# EAGLE design filterCard (EAGLE 8.0.1)
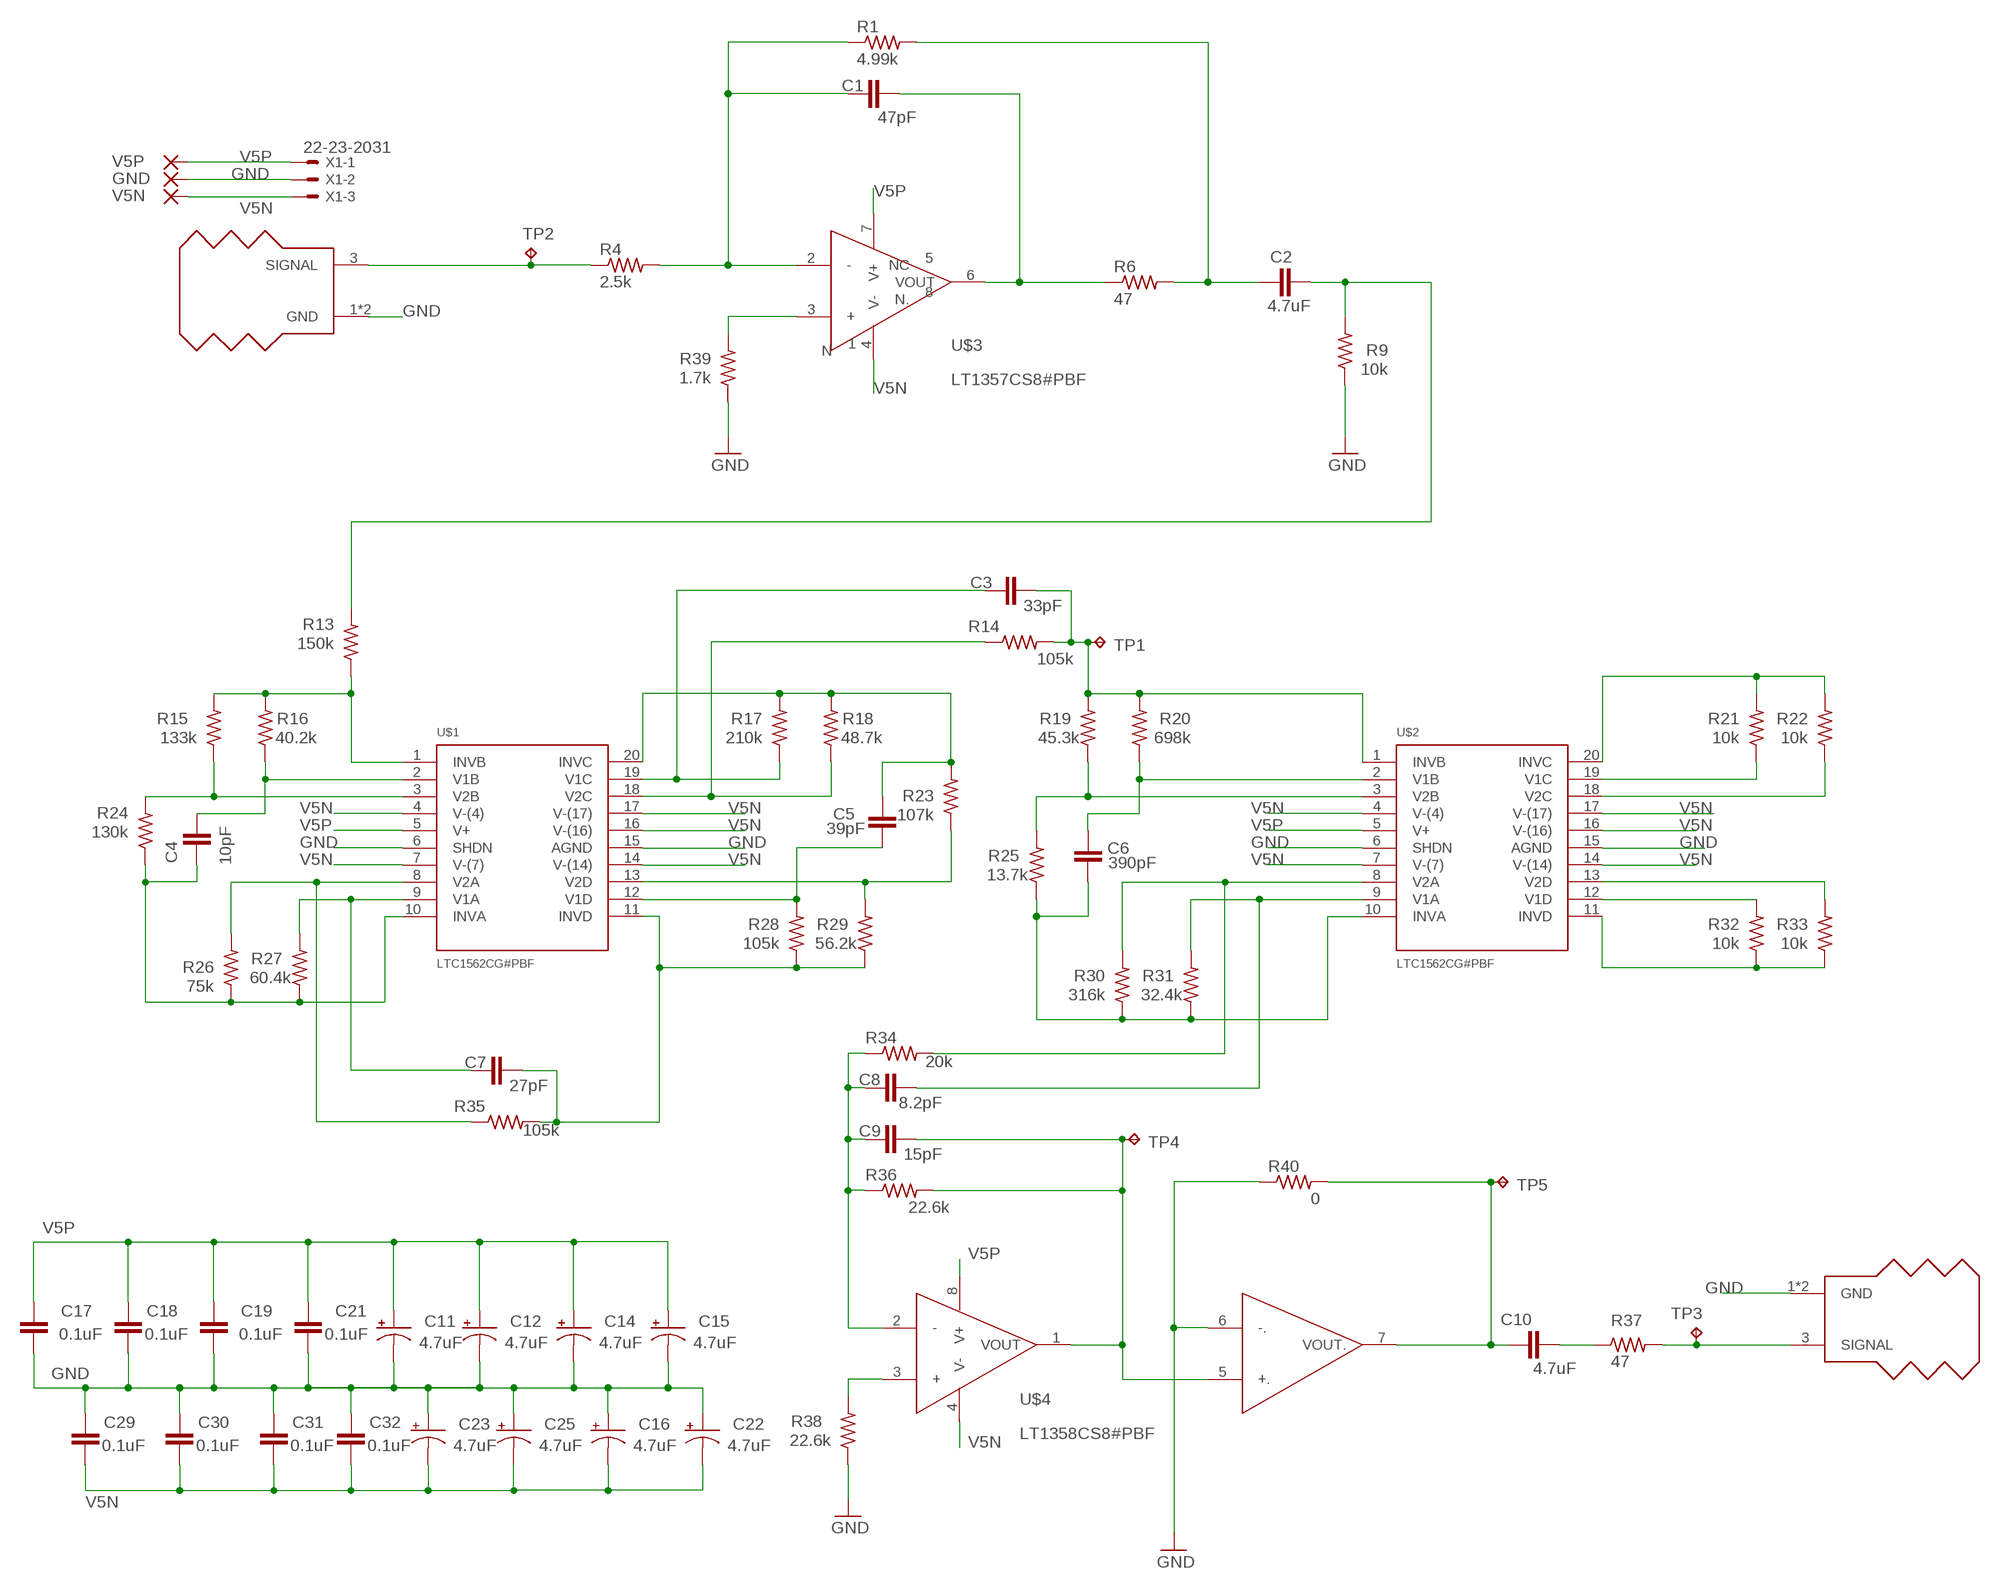
[diagram p0: schematic, sheet 1]

## Parts
C1  47pF  C0603  [0603]
C2  4.7uF  C1206  [1206]
C3  33pF  C1206  [1206]
C4  10pF  C1206  [1206]
C5  39pF  C1206  [1206]
C6  390pF  C1206  [1206]
C7  27pF  C1206  [1206]
C8  8.2pF  C1206  [1206]
C9  15pF  C1206  [1206]
C10  4.7uF  C1206  [1206]
C11  4.7uF  C1206-POLAR  [1206-POLAR]
C12  4.7uF  C1206-POLAR  [1206-POLAR]
C14  4.7uF  C1206-POLAR  [1206-POLAR]
C15  4.7uF  C1206-POLAR  [1206-POLAR]
C16  4.7uF  C1206-POLAR  [1206-POLAR]
C17  0.1uF  C0603  [0603]
C18  0.1uF  C0603  [0603]
C19  0.1uF  C0603  [0603]
C21  0.1uF  C0603  [0603]
C22  4.7uF  C1206-POLAR  [1206-POLAR]
C23  4.7uF  C1206-POLAR  [1206-POLAR]
C25  4.7uF  C1206-POLAR  [1206-POLAR]
C29  0.1uF  C0603  [0603]
C30  0.1uF  C0603  [0603]
C31  0.1uF  C0603  [0603]
C32  0.1uF  C0603  [0603]
GND  ground  2,54/0,8  [2,54/0,8]
R1  4.99k  R-US_R0603  [R0603]
R4  2.5k  R-US_R0603  [R0603]
R6  47  R-US_R1206  [R1206]
R9  10k  R-US_R1206  [R1206]
R13  150k  R-US_R1206  [R1206]
R14  105k  R-US_R1206  [R1206]
R15  133k  R-US_R1206  [R1206]
R16  40.2k  R-US_R1206  [R1206]
R17  210k  R-US_R1206  [R1206]
R18  48.7k  R-US_R1206  [R1206]
R19  45.3k  R-US_R1206  [R1206]
R20  698k  R-US_R1206  [R1206]
R21  10k  R-US_R1206  [R1206]
R22  10k  R-US_R1206  [R1206]
R23  107k  R-US_R1206  [R1206]
R24  130k  R-US_R1206  [R1206]
R25  13.7k  R-US_R1206  [R1206]
R26  75k  R-US_R1206  [R1206]
R27  60.4k  R-US_R1206  [R1206]
R28  105k  R-US_R1206  [R1206]
R29  56.2k  R-US_R1206  [R1206]
R30  316k  R-US_R1206  [R1206]
R31  32.4k  R-US_R1206  [R1206]
R32  10k  R-US_R1206  [R1206]
R33  10k  R-US_R1206  [R1206]
R34  20k  R-US_R1206  [R1206]
R35  105k  R-US_R1206  [R1206]
R36  22.6k  R-US_R1206  [R1206]
R37  47  R-US_R1206  [R1206]
R38  22.6k  R-US_R1206  [R1206]
R39  1.7k  R-US_R0603  [R0603]
R40  0  R-US_R0805  [R0805]
TP1  TPPAD1-17  [P1-17]
TP2  TPPAD1-13  [P1-13]
TP3  TPPAD1-13  [P1-13]
TP4  TPPAD1-17  [P1-17]
TP5  TPPAD1-17  [P1-17]
U$1  LTC1562CG#PBF  [TSSOP20]
U$2  LTC1562CG#PBF  [TSSOP20]
U$3  LT1357CS8#PBF  [8-SOIC]
U$4  LT1358CS8#PBF  [8-SOIC]
U$5  MY_SMASMD  [MY_SMA]
U$6  MY_SMASMD  [MY_SMA]
V5N  -5  2,54/0,8  [2,54/0,8]
V5P  5  2,54/0,8  [2,54/0,8]
X1  22-23-2031  [22-23-2031]

## Nets
GND: C11.- C12.- C14.- C15.- C16.+ C17.2 C18.2 C19.2 C21.2 C22.+ C23.+ C25.+ C29.1 C30.1 C31.1 C32.1 GND.1(P) R9.1 R38.1 R39.1 R40.1 U$1.6(SHDN) U$1.15(AGND) U$2.6(SHDN) U$2.15(AGND) U$4.6(-.) U$5.1(GND) U$5.2(GND) U$6.1(GND) U$6.2(GND) X1.2
N$1: C7.1 R27.2 U$1.9(V1A)
N$2: R26.2 R35.1 U$1.8(V2A)
N$3: C4.2 R24.1 R26.1 R27.1 U$1.10(INVA)
N$4: R15.1 R24.2 U$1.3(V2B)
N$5: C7.2 R28.1 R29.1 R35.2 U$1.11(INVD)
N$6: C4.1 R16.1 U$1.2(V1B)
N$7: R39.2 U$3.3(+)
N$8: C5.2 R28.2 U$1.12(V1D)
N$9: R13.1 R15.2 R16.2 U$1.1(INVB)
N$10: R23.1 R29.2 U$1.13(V2D)
N$11: C1.1 R1.1 R4.2 U$3.2(-)
N$12: C3.2 R14.2 R19.2 R20.2 TP1.TP U$2.1(INVB)
N$13: C3.1 R17.1 U$1.19(V1C)
N$14: R14.1 R18.1 U$1.18(V2C)
N$15: C5.1 R17.2 R18.2 R23.2 U$1.20(INVC)
N$16: C10.1 R40.2 TP5.TP U$4.7(VOUT.)
N$17: R19.1 R25.2 U$2.3(V2B)
N$18: C6.1 R20.1 U$2.2(V1B)
N$19: C1.2 R6.1 U$3.6(VOUT)
N$20: C6.2 R25.1 R30.1 R31.1 U$2.10(INVA)
N$21: C8.2 R31.2 U$2.9(V1A)
N$22: R30.2 R34.2 U$2.8(V2A)
N$23: C10.2 R37.1
N$24: R21.1 U$2.19(V1C)
N$25: R22.1 U$2.18(V2C)
N$26: R21.2 R22.2 U$2.20(INVC)
N$27: R32.2 U$2.12(V1D)
N$28: R33.2 U$2.13(V2D)
N$29: R32.1 R33.1 U$2.11(INVD)
N$30: C2.1 R1.2 R6.2
N$31: R4.1 TP2.TP U$5.3(SIGNAL)
N$32: C2.2 R9.2 R13.2
N$33: R37.2 TP3.TP U$6.3(SIGNAL)
N$35: C8.1 C9.1 R34.1 R36.1 U$4.2(-)
N$37: R38.2 U$4.3(+)
N$38: C9.2 R36.2 TP4.TP U$4.1(VOUT) U$4.5(+.)
V5N: C16.- C22.- C23.- C25.- C29.2 C30.2 C31.2 C32.2 U$1.4(V-(4)) U$1.7(V-(7)) U$1.14(V-(14)) U$1.16(V-(16)) U$1.17(V-(17)) U$2.4(V-(4)) U$2.7(V-(7)) U$2.14(V-(14)) U$2.16(V-(16)) U$2.17(V-(17)) U$3.4(V-) U$4.4(V-) V5N.1(P) X1.3
V5P: C11.+ C12.+ C14.+ C15.+ C17.1 C18.1 C19.1 C21.1 U$1.5(V+) U$2.5(V+) U$3.7(V+) U$4.8(V+) V5P.1(P) X1.1
Unconnected: U$3.1(N) U$3.5(NC) U$3.8(N.)

## Library data of the parts
C1 C17-C19 C21 C29-C32 = filtercard_parts:C0603
C2-C10 = filtercard_parts:C1206
C11 C12 C14-C16 C22 C23 C25 = filtercard_parts:C1206-POLAR
GND V5N V5P = wirepad:2,54/0,8: THROUGH-HOLE PAD
R1 R4 R6 R9 R13-R22 R28 R32 R33 R35 R37-R40 = resistor:R-US_: RESISTOR, American symbol
R23-R27 R29-R31 R34 R36 = rcl:R-US_: RESISTOR, American symbol
TP1-TP5 = testpad:TP: Test pad
U$1 U$2 = filtercard_parts:LTC1562CG#PBF
U$3 = filtercard_parts:LT1357CS8#PBF
U$4 = filtercard_parts:LT1358CS8#PBF
U$5 U$6 = MY_SMA:MY_SMA
X1 = con-molex:22-23-2031: .100" (2.54mm) Center Header - 3 Pin; MF: MOLEX; MPN: 22-23-2031; OC_FARNELL: 1462950; OC_NEWARK: 30C0862

## Board
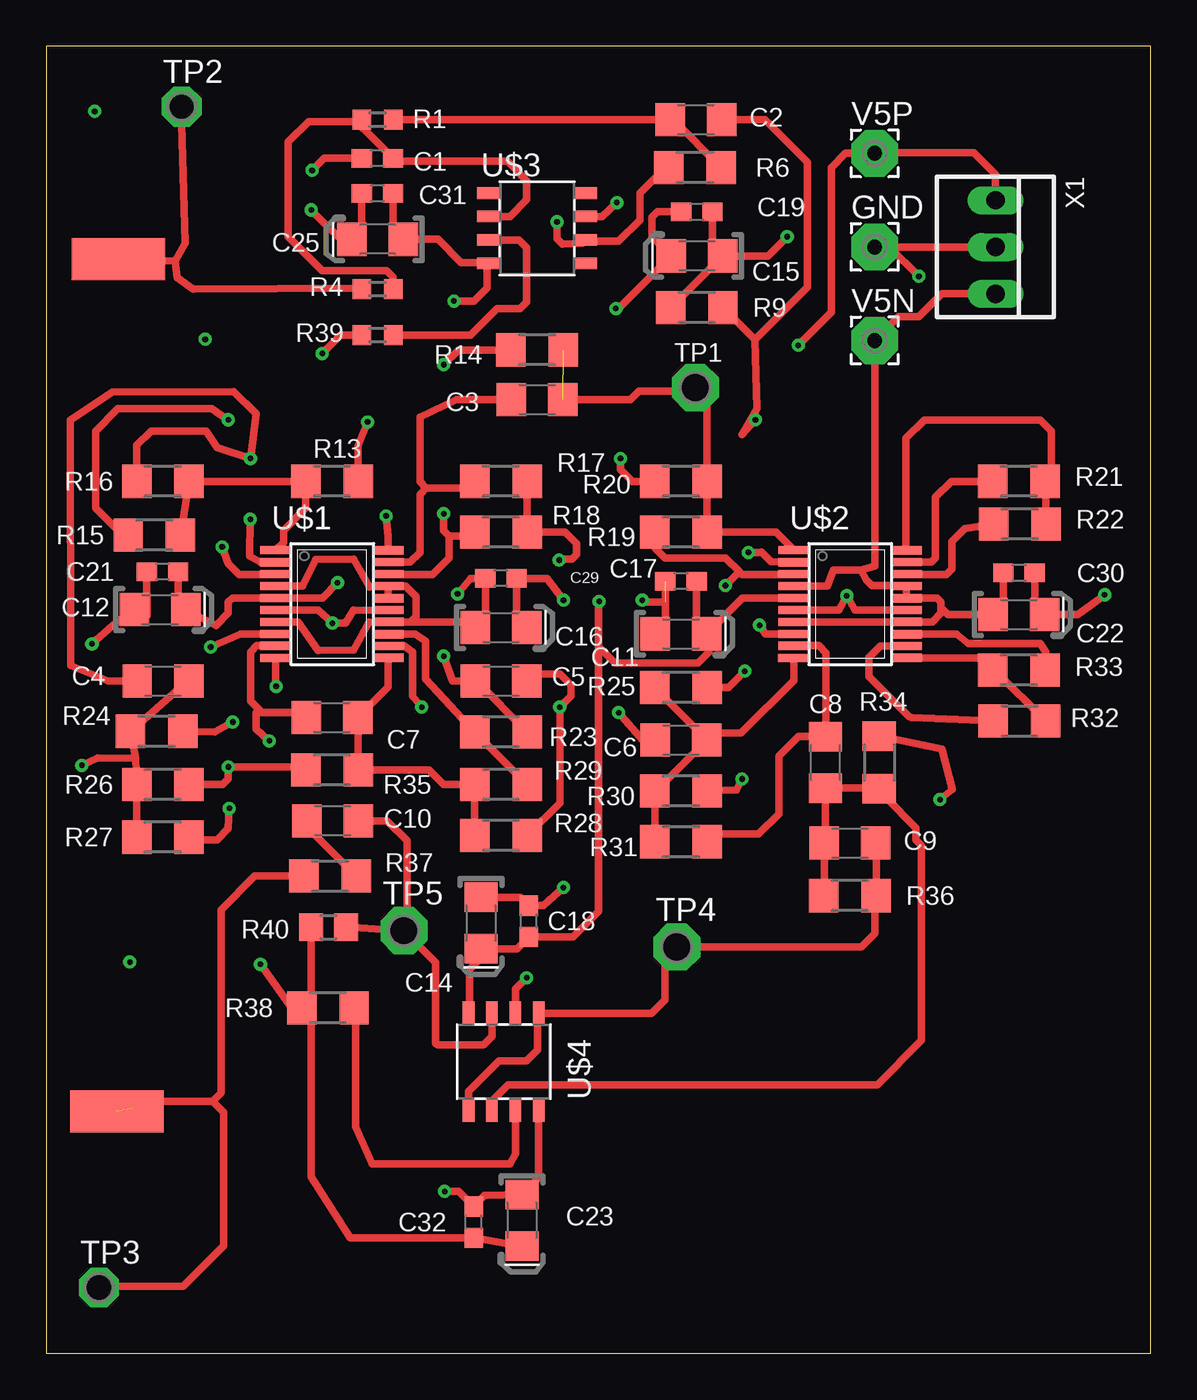
[diagram p1: board, top side]
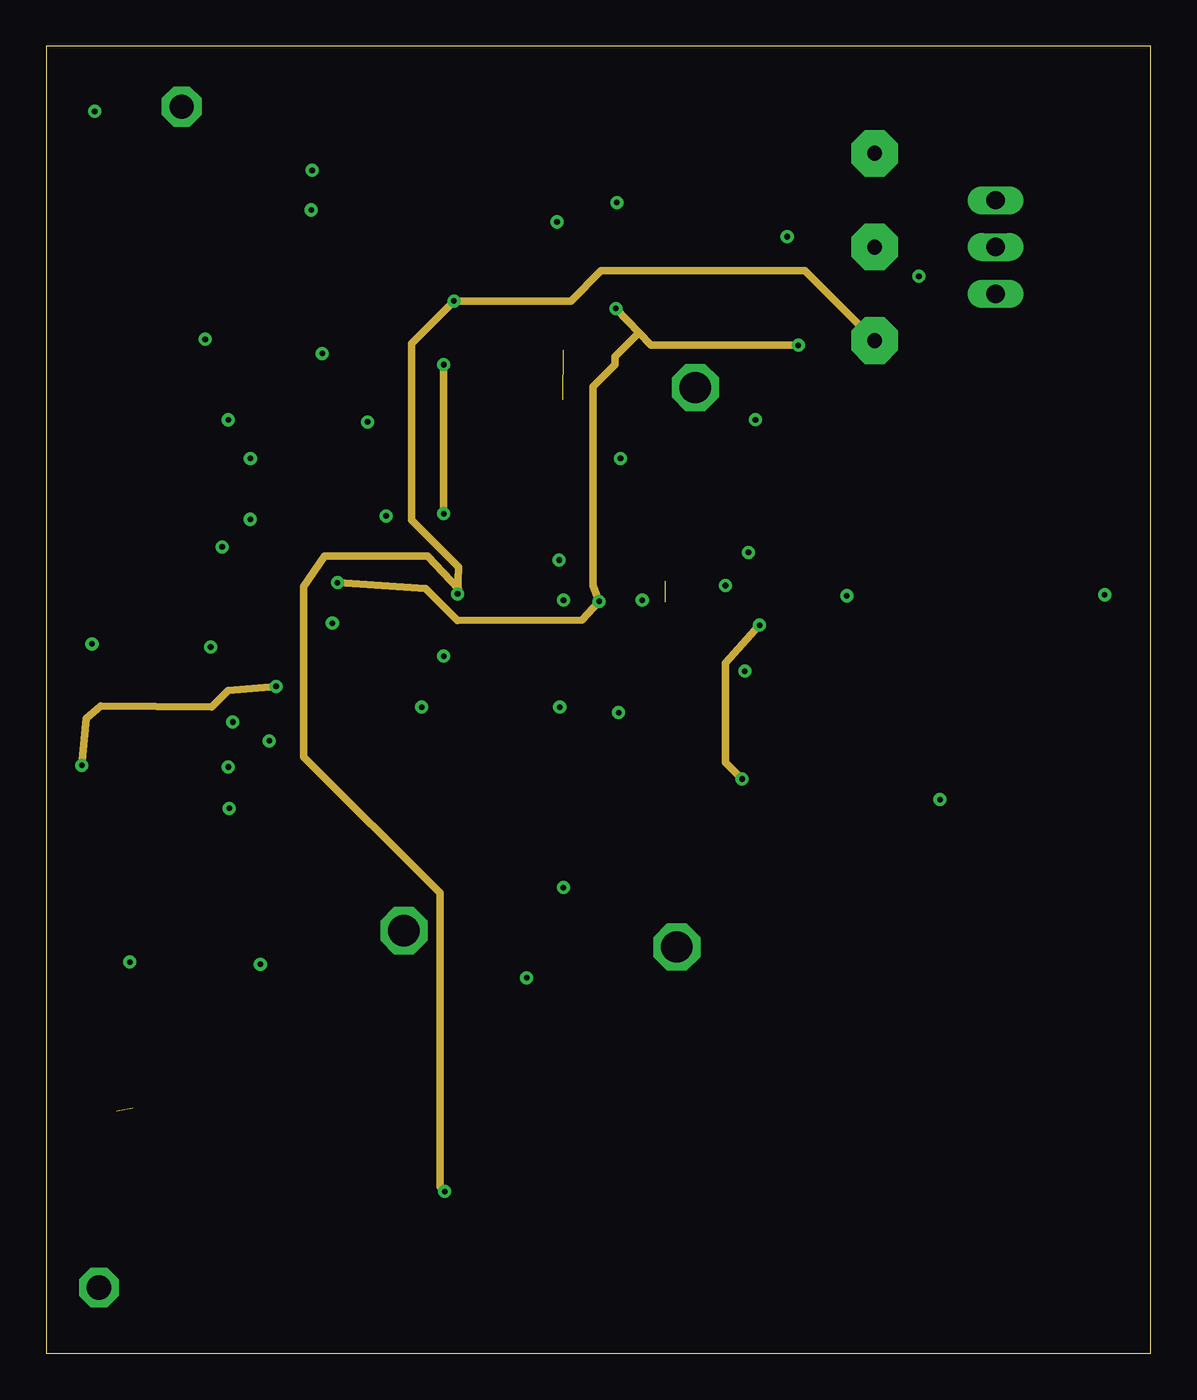
[diagram p2: board, inner layer Route2]
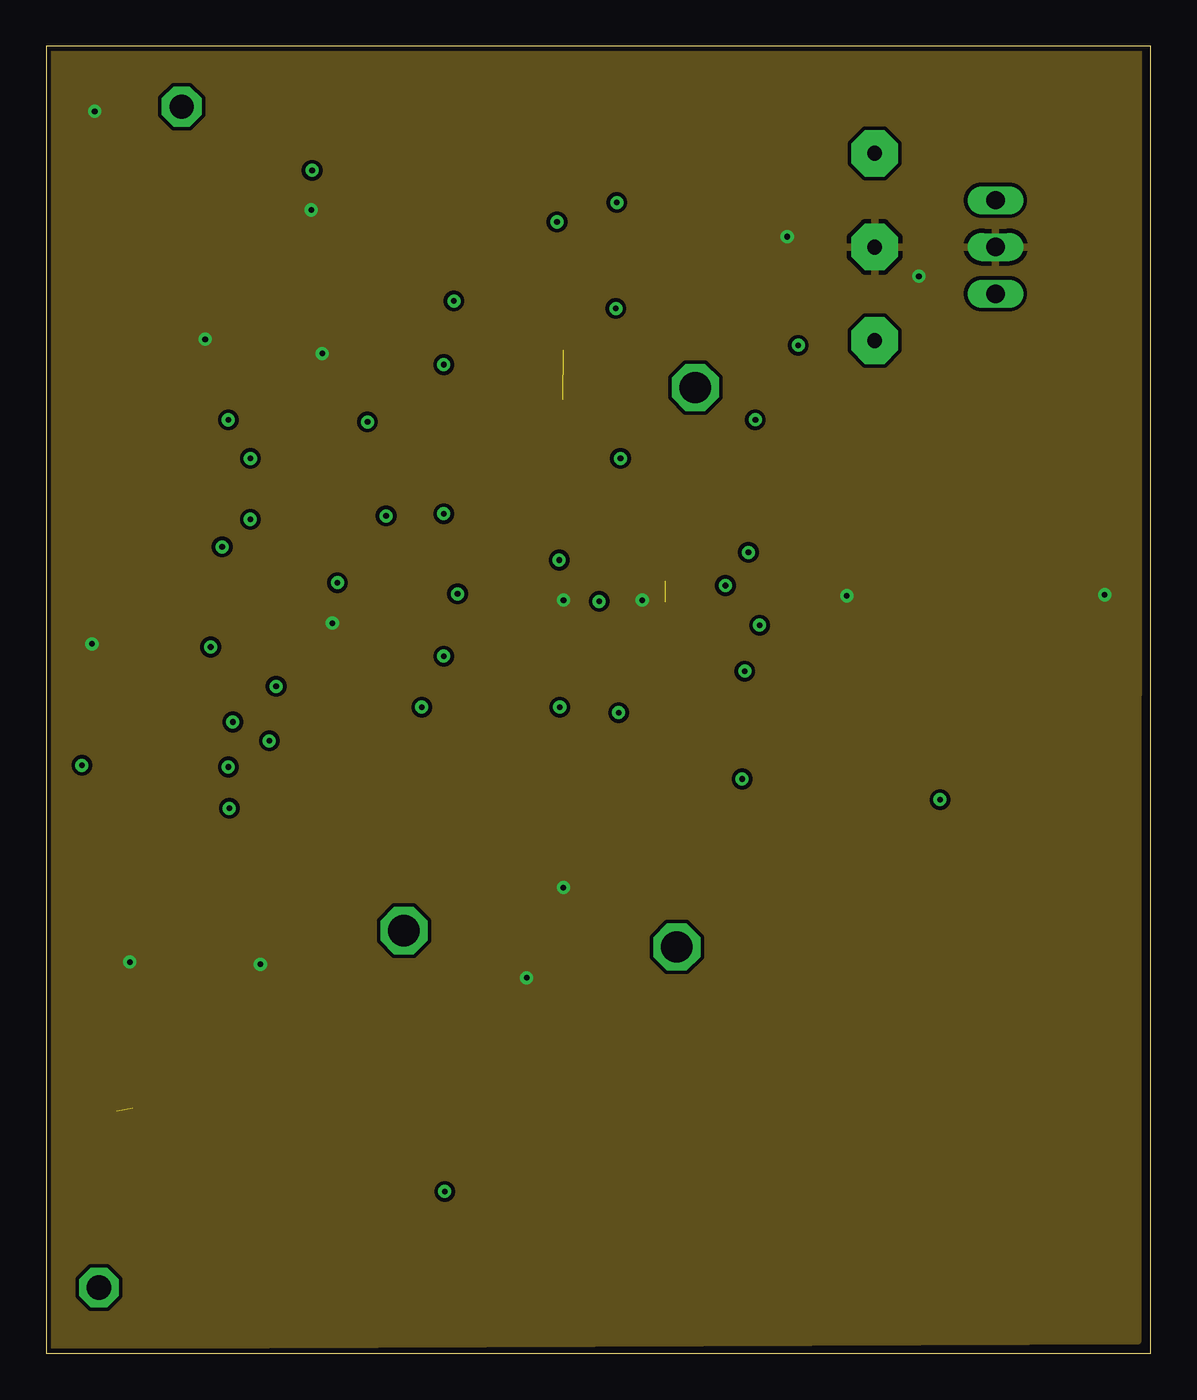
[diagram p3: board, inner layer Route3]
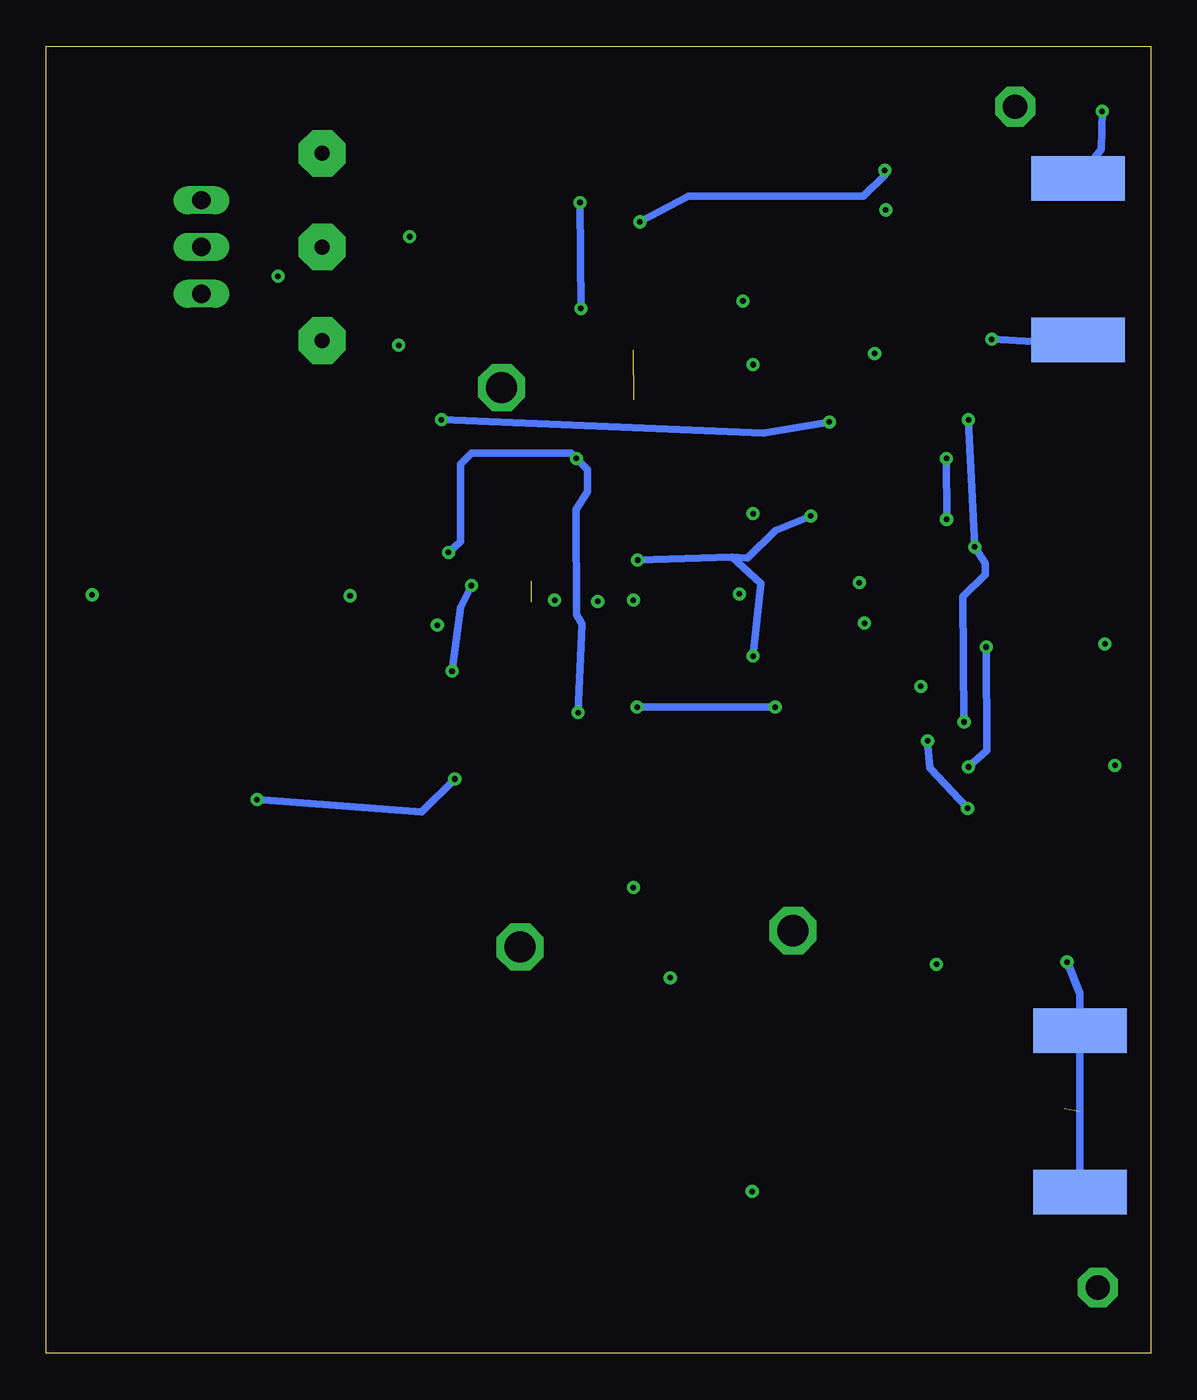
[diagram p4: board, bottom side, seen from below]

Size 60 x 71 mm. Coordinates in mm from the lower left corner, seen from the top.
Outline: 0,0 60,0 60,71 0,71 0,0
Copper layers (1*2*3*16): Top 0.035mm / dielectric 1.5mm / Route2 0.035mm / dielectric 0.15mm / Route3 0.035mm / dielectric 0.2mm / Bottom 0.035mm
Design rules "4pcb *": minimum track width 8mil, minimum drill 10mil, track to track 8mil, track to pad 6mil, pad to pad 6mil, via to via 8mil, smd to smd 8mil, copper to edge 10mil, drill to drill 8mil, minimum pad ring 10mil, minimum via ring 8mil, stop-mask expansion 4mil, vias tented up to drill 0mil, thermal gap 10mil

### Footprints (pad centres in the part's own frame; a part is rotated, then mirrored left to right if it is on the bottom)
0603 = smd 1.1 x 1: 1 -0.85,0; 2 0.85,0
1206 = smd 1.6 x 1.8: 1 -1.4,0; 2 1.4,0
1206-POLAR = smd 1.6 x 1.8: + 1.4,0; - -1.4,0
2,54/0,8 = drill 0.813 pad 2.54 octagon: 1 0,0
R0603 = smd 1 x 1.1: 1 -0.85,0; 2 0.85,0
R1206 = smd 1.6 x 1.803: 1 -1.422,0; 2 1.422,0
R0805 = smd 1.3 x 1.5: 1 -0.95,0; 2 0.95,0
P1-17 = drill 1.702 pad 2.54 octagon: TP 0,0
P1-13 = drill 1.321 pad 2.159 octagon: TP 0,0
TSSOP20 = smd 0.45 x 1.7: 1 -2.927,-3.047; 2 -2.272,-3.042; 3 -1.627,-3.052; 4 -0.972,-3.042; 5 -0.322,-3.042; 6 0.328,-3.047; 7 0.978,-3.047; 8 1.628,-3.047; 9 2.263,-3.047; 10 2.928,-3.052; 11 2.923,3.052; 12 2.278,3.057; 13 1.638,3.047; 14 0.973,3.052; 15 0.328,3.052; 16 -0.312,3.052; 17 -0.972,3.052; 18 -1.622,3.052; 19 -2.277,3.052; 20 -2.917,3.047
8-SOIC = smd 1.27 x 0.635: 1 -2.629,1.905; 2 -2.629,0.635; 3 -2.629,-0.635; 4 -2.629,-1.905; 5 2.629,-1.905; 6 2.629,-0.635; 7 2.629,0.635; 8 2.629,1.905
MY_SMA = smd 5.08 x 2.413 bottom: 1 2.54,4.381; 2 2.54,-4.381 | smd 5.08 x 2.286: 3 2.54,0
22-23-2031 = drill 1 long: 1 -2.54,0; 2 0,0; 3 2.54,0

### Placement (x,y rotation side)
C1  18,64.9 180 top
C2  35.29,67 0 top
C3  26.67,51.8 0 top
C4  6.35,36.51 0 top
C5  24.71,36.51 0 top
C6  34.48,33.31 0 top
C7  15.53,34.54 0 top
C8  42.33,32.1 90 top
C9  43.66,27.72 0 top
C10  15.57,28.92 180 top
C11  34.48,39.08 0 top
C12  6.19,40.4 0 top
C14  23.62,23.38 270 top
C15  35.34,59.6 180 top
C16  24.71,39.43 0 top
C17  34.48,41.94 180 top
C18  26.22,23.47 90 top
C19  35.34,62 0 top
C21  6.33,42.46 180 top
C22  52.84,40.13 0 top
C23  25.85,7.23 270 top
C25  18,60.5 180 top
C29  24.71,42.09 180 top
C30  52.84,42.39 180 top
C31  18,63 0 top
C32  23.23,7.13 90 top
GND  45,60.09 0 top
R1  18,67 0 top
R4  18,57.8 0 top
R6  35.24,64.4 0 top
R9  35.34,56.8 0 top
R13  15.53,47.36 0 top
R14  26.67,54.5 0 top
R15  5.88,44.44 0 top
R16  6.35,47.36 0 top
R17  24.71,47.36 0 top
R18  24.71,44.6 0 top
R19  34.48,44.6 0 top
R20  34.48,47.36 0 top
R21  52.84,47.36 0 top
R22  52.89,45.04 0 top
R23  24.71,33.75 0 top
R24  6.01,33.79 0 top
R25  34.48,36.16 0 top
R26  6.35,30.9 0 top
R27  6.35,28.04 0 top
R28  24.71,28.14 0 top
R29  24.71,30.9 0 top
R30  34.48,30.55 0 top
R31  34.48,27.79 0 top
R32  52.86,34.34 180 top
R33  52.84,37.12 0 top
R34  45.25,32.1 90 top
R35  15.53,31.69 0 top
R36  43.66,24.86 0 top
R37  15.42,25.93 180 top
R38  15.31,18.77 0 top
R39  18,55.3 0 top
R40  15.34,23.15 0 top
TP1  35.26,52.45 0 top
TP2  7.37,67.71 0 top
TP3  2.88,3.58 0 top
TP4  34.26,22.07 0 top
TP5  19.43,22.96 0 top
U$1  15.53,40.7 270 top
U$2  43.66,40.7 270 top
U$3  26.67,61.1 0 top
U$4  24.85,15.85 90 top
U$5  1.4,59.43 0 top
U$6  1.31,13.14 0 top
V5N  45,55.01 0 top
V5P  45,65.17 0 top
X1  51.56,60.09 270 top

### Tracks (layer width: path | path; a pad name or v marks a point on that pad's centre or on a via)
GND  (via drill 0.3 pad 0.51)  (1 unrouted)
  Top 0.406: C31.1 17.15,61.05 C25.+ 16,60.5 v14.4,62.1 | R9.1 33.94,56.8 C15.- | R39.1 16,55.3 v15,54.3 | C15.- 39.2,59.6 v40.25,60.65 | X1.2 GND.1 45.81,60.09 v47.4,58.5 | C19.2 36.19,60.15 C15.- | R40.1 14.39,19.27 R38.1 | R38.1 13.33,18.77 v11.64,21.14 | C14.- 25.77,24.78 C18.2 27.02,24.32 v28.1,25.3 | C23.+ 23.25,6.28 C32.1 16.52,6.28 14.4,9.6 14.4,18.25 R38.1 | C16.+ 25.56,39.98 C29.1 27.21,42.09 v28.1,40.91 | C17.2 33.63,39.63 C11.- | 33.63,40.8 32.7,40.8 v32.38,40.91 | C30.1 53.69,40.68 C22.+ 56.03,40.13 v57.5,41.2 | C21.2 5.5,40.08 C12.- 3.63,39.53 v2.49,38.53 | U$2.6 43.07,40.37 v43.48,41.15 43.93,40.37 U$2.15 | U$4.6 25.48,19.79 v26.1,20.4 | U$1.6 14.79,40.36 v15.55,39.66 16.28,39.66 16.69,40.38 18.56,40.35 U$1.15
  Bottom 0.406: U$5.1 2.7,65.4 v2.65,67.46 | U$5.2 6.34,54.94 v8.64,55.08 | U$6.2 U$6.1 3.85,19.55 v4.55,21.26
  pour Route3: 0.3,70.79 0.35,0.43 59.29,0.7 59.32,70.75
N$1  (via drill 0.3 pad 0.51)
  Top 0.406: U$1.9 11.44,38.44 11.1,38.1 11.1,35.44 11.73,34.8 | 11.73,34.8 11.4,34.8 11.4,33.9 v12.12,33.26 | 11.73,34.8 13.87,34.8 C7.1 | v9.95,29.6 9.9,28.5 9.3,27.9 7.91,27.9 R27.2
  Bottom 0.406: v12.12,33.26 12,31.8 v9.95,29.6
N$2  (via drill 0.3 pad 0.51)
  Top 0.406: U$1.8 10.57,39.07 v8.94,38.36 | R26.2 9.6,30.9 9.9,31.2 v9.9,31.85 13.69,31.85 R35.1
  Bottom 0.406: v8.94,38.36 8.91,32.75 v9.9,31.85
N$3  (via drill 0.3 pad 0.51)
  Top 0.406: C4.2 7.69,36.51 R24.1 | U$1.10 12.48,36.18 v12.49,36.23 | 4.48,33.3 R24.1 | R24.1 4.88,32.3 | 4.88,32.3 R26.1 R27.1 | 4.88,32.3 2.8,32.34 v1.95,31.94
  Route2 0.406: v12.49,36.23 9.9,36 9,35.1 2.98,35.17 2.18,34.48 v1.95,31.94
N$4  (via drill 0.3 pad 0.51)
  Top 0.406: R15.1 4.16,44.44 2.7,45.9 2.7,50.1 3.9,51.3 9,51.3 v9.9,50.7 | v9.56,43.8 9.9,42.9 10.5,42.3 12.45,42.3 U$1.3 | R24.2 9.15,33.75 v10.14,34.29
  Bottom 0.406: v9.9,50.7 v9.56,43.8 9,42.9 9,42.3 10.2,41.1 v10.14,34.29
N$5
  Top 0.406: U$1.11 18.58,36.19 C7.2 16.95,34.52 R35.2 20.81,31.69 21.6,30.9 R29.1 R28.1
N$6  (via drill 0.3 pad 0.51)
  Top 0.406: R16.1 4.93,49.33 5.7,50.1 8.7,50.1 9.3,49.2 v11.1,48.6 11.4,51.04 10.2,52.24 3.6,52.2 1.32,50.69 1.35,37.35 3.39,36.51 C4.1 | v11.09,45.3 11.05,43.3 11.63,42.97 U$1.2
  Bottom 0.406: v11.1,48.6 v11.09,45.3
N$7
  Top 0.406: R39.2 23.05,55.3 24.5,56.75 25.75,56.75 26.1,57.1 26.1,60.05 25.7,60.45 24.06,60.45 U$3.3
N$8  (via drill 0.3 pad 0.51)
  Top 0.406: U$1.12 19.48,38.42 19.91,38.1 19.91,35.7 v20.4,35.1 | C5.2 26.49,36.9 27.9,36.9 28.5,36.3 28.5,35.7 v27.9,35.1 27.9,29.91 R28.2
  Bottom 0.406: v20.4,35.1 v27.9,35.1
N$9
  Top 0.406: U$1.1 12.9,44.05 12.9,44.7 14.11,45.91 R13.1 R16.2 R15.2
N$10
  Top 0.406: U$1.13 20.04,39.06 20.61,38.7 20.61,36.64 R23.1 R29.2
N$11
  Top 0.406: R1.1 17.15,66.6 17.38,66.38 | 17.38,66.38 C1.1 19,64.75 25.05,64.75 26.1,63.7 26.1,62.65 25.19,61.74 U$3.2 | R4.2 18.85,58.45 18.5,58.8 15,58.8 13.15,60.65 13.15,65.8 14.25,66.9 16.85,66.9 17.38,66.38
N$12  (1 unrouted)
  Top 0.406: C3.2 31.75,51.8 32.2,52.25 35.06,52.25 TP1.TP 35.9,51.81 R20.2 R19.2 39.64,44.6 U$2.1
N$13
  Top 0.406: C3.1 22.3,51.8 20.3,50.85 20.3,47.35 20.65,47 | R17.1 22.92,47 20.65,47 | U$1.19 19.78,42.98 20.3,43.5 20.3,46.65 20.65,47
N$14  (via drill 0.3 pad 0.51)
  Top 0.406: R14.1 22.4,54.5 v21.6,53.7 | v21.6,45.6 21.6,44.7 21.9,44.4 | 21.9,44.4 23.08,44.4 R18.1 | 21.9,44.4 21.9,43.2 21,42.3 18.6,42.3 U$1.18
  Route2 0.406: v21.6,53.7 v21.6,45.6
N$15  (via drill 0.3 pad 0.51)
  Top 0.406: R17.2 R18.2 | U$1.20 18.57,44.38 v18.47,45.48 | 26.33,44.4 R18.2 | 26.23,44.7 R18.2 | v21.6,37.87 22.09,36.51 C5.1 23.37,36.51 R23.2 | R18.2 28.18,44.6 28.81,43.97 28.81,43.38 28.57,43.14 27.92,43.14 v27.87,43.09
  Bottom 0.406: v18.47,45.48 20.4,44.7 21.9,43.2 22.75,43.26 | 22.75,43.26 v27.87,43.09 | v21.6,37.87 21.16,41.82 22.75,43.26
N$16
  Top 0.406: TP5.TP R40.2 | C10.1 18.53,28.92 19.6,27.85 19.6,23.13 TP5.TP | U$4.7 24.21,17.21 23.75,16.75 21.25,16.75 21.15,16.85 21.15,21.24 TP5.TP
N$17  (via drill 0.3 pad 0.51)
  Top 0.406: R19.1 33.06,43.74 33.6,43.2 36.9,43.2 37.65,42.45 | 37.65,42.45 37.8,42.3 40.58,42.3 U$2.3 | R25.2 37.06,36.16 v37.95,37.05 | v36.9,41.7 37.65,42.45
  Bottom 0.406: v37.95,37.05 37.5,40.5 v36.9,41.7
N$18  (via drill 0.3 pad 0.51)
  Top 0.406: R20.1 31.84,47.36 31.2,48 v31.2,48.6 | 38.7,43.5 v38.15,43.5 38.84,43.52 39.37,43 U$2.2 | C6.1 32.39,33.31 v31.1,34.8
  Bottom 0.406: v38.15,43.5 37.5,44.1 37.5,48.3 36.9,48.9 31.5,48.9 v31.2,48.6 30.6,48 30.6,46.8 31.23,45.83 31.2,40.13 30.9,39.6 v31.1,34.8
N$19  (via drill 0.3 pad 0.51)
  Top 0.406: R6.1 33.65,64.4 32.25,63 32.25,61.55 31.1,60.4 29.37,60.4 U$3.6 29.13,60.3 28.05,60.25 27.75,60.55 v27.75,61.45 | C1.2 15.1,64.9 v14.45,64.25
  Bottom 0.406: v14.45,64.25 14.45,64 15.6,62.85 25.1,62.85 v27.75,61.45
N$20
  Top 0.406: R25.1 33.06,36.13 C6.2 | R31.1 R30.1 33.12,30.55 C6.2 | U$2.10 40.61,36.56 37.75,33.7 36.28,33.7 C6.2
N$21
  Top 0.406: R31.2 36.32,28.2 38.7,28.2 39.8,29.3 39.8,32.45 40.85,33.5 C8.2 42.35,33.52 42.35,38.05 41.96,38.44 U$2.9
N$22  (via drill 0.3 pad 0.51)
  Top 0.406: v37.8,31.2 37.5,30.6 R30.2 | U$2.8 39.08,39.07 v38.75,39.55 | R34.2 47.73,33.01 48.65,32.83 49.21,30.64 v48.55,30.08
  Route2 0.406: v38.75,39.55 36.9,37.5 36.9,32.1 v37.8,31.2
  Bottom 0.406: v48.55,30.08 39.6,29.4 v37.8,31.2
N$23
  Top 0.406: C10.2 14.17,28.6 R37.1
N$24
  Top 0.406: R21.1 49.16,47.36 48.3,46.5 48.3,43.2 48.08,42.98 U$2.19
N$25
  Top 0.406: R22.1 49.89,44.79 49.2,44.1 49.2,42.6 48.9,42.3 46.73,42.3 U$2.18
N$26
  Top 0.406: R22.2 R21.2 54.6,47.7 54.6,50.1 54,50.7 47.7,50.7 46.71,49.71 U$2.20
N$27
  Top 0.406: U$2.12 45.32,38.42 44.7,37.8 44.7,36.75 46.85,34.6 47,34.54 R32.2
N$28
  Top 0.406: U$2.13 49.44,39.06 50.1,38.55 54,38.55 54.3,38.1 54.3,37.16 R33.2 54,37.38
N$29
  Top 0.406: R32.1 51.51,37.12 R33.1 50.76,37.78 U$2.11
N$30
  Top 0.406: R6.2 34.06,67 C2.1 R1.2
N$31
  Top 0.406: U$5.3 7.03,59.33 | 7.03,59.33 7.55,60.3 7.35,67.69 TP2.TP | 7.03,59.33 7.13,58.42 8,57.8 17.1,57.85 R4.1
N$32  (via drill 0.3 pad 0.51)
  Top 0.406: R9.2 36.76,56.79 38.5,55.05 | 38.5,55.05 38.62,51.3 37.8,49.89 v38.52,50.7 | 17.15,47.56 R13.2 16.95,49.31 v17.46,50.59 | C2.2 39.05,67 41.35,64.7 41.35,57.9 38.5,55.05
  Bottom 0.406: v38.52,50.7 21.05,49.98 v17.46,50.59
N$33  (1 unrouted)
  Top 0.406: R37.2 11.33,25.93 9.5,24.1 9.5,14.15 9.05,13.7 | 9.05,13.7 5.1,13.7 4.7,13.3 | 9.05,13.7 9.65,13.1 9.65,5.85 7.45,3.65 2.95,3.65 TP3.TP
N$35
  Top 0.406: U$4.2 24.21,13.71 25.1,14.6 45.15,14.6 47.55,17 47.55,27.6 47.25,27.9 47.25,28.55 45.6,30.2 45.6,30.32 R34.1 45.22,30.7 C8.1 42.33,27.79 C9.1 42.26,24.88 | 42.26,24.88 R36.1 42.26,24.88
N$37
  Top 0.406: U$4.3 25.48,10.84 25.2,10.3 17.7,10.3 16.8,12.3 16.8,18.7 R38.2
N$38
  Top 0.406: C9.2 45.08,27.7 R36.2 45,24.78 45,22.8 44.27,22.07 TP4.TP 33.6,21.42 33.6,19.2 32.88,18.48 U$4.5 26.7,18.42 26.7,16.5 26.1,15.9 24.6,15.9 22.95,14.25 U$4.1
V5N  (via drill 0.3 pad 0.51)
  Top 0.406: U$1.17 U$1.16 | 19.8,39.73 U$1.14 18.55,39.7 17.53,39.72 16.7,38.19 14.77,38.17 13.68,39.72 U$1.7 | 19.8,39.73 23.01,39.73 C16.- 23.86,39.98 C29.2 23.04,42.09 v22.35,41.25 | U$1.17 19.53,41.67 20.1,41.1 20.1,40.03 19.8,39.73 | C30.2 51.99,40.68 C22.- 48.97,40.13 48.6,40.5 | U$2.7 U$2.14 48.13,39.73 48.6,40.2 48.6,40.5 | 48.6,40.5 48.6,40.8 48.39,41.01 U$2.16 U$2.17 46.68,41.7 44.85,41.7 44.55,42 44.25,42.53 | U$2.4 42.42,41.67 42.75,42.53 44.25,42.53 | U$1.4 13.92,41.67 14.65,43.12 16.71,43.15 17.58,41.63 18.55,41.7 U$1.17 | C31.2 18.85,61.05 C25.- 21.3,60.5 22.55,59.25 23.99,59.25 U$3.4 23.95,59.11 23.95,57.85 23.25,57.15 v22.15,57.15 | v21.65,8.8 22.41,8.8 C32.2 23.83,8.58 23.93,8.58 C23.- 26.75,9.54 U$4.4 | X1.3 48.65,57.55 47.4,56.3 46.29,56.3 V5N.1 45,42.75 44.25,42.53
  Route2 0.406: v21.65,8.8 21.4,9.05 21.4,25 14,32.4 14,41.65 15.13,43.29 20.72,43.31 22.4,41.5 v22.35,41.25 22.4,42.7 19.85,45.25 19.85,54.85 v22.15,57.15 28.5,57.15 30.15,58.8 41.21,58.8 V5N.1
V5P  (via drill 0.3 pad 0.51)
  Top 0.406: C19.1 33.2,62 32.9,61.7 32.9,60.64 C15.+ 31.09,56.75 v30.95,56.75 | X1.1 51.56,64.04 50.4,65.2 45.03,65.2 V5P.1 43.42,65.17 42.65,64.4 42.65,56.55 v40.85,54.75 | C17.1 35.33,39.63 C11.+ | 30,38.4 30,24 28.62,22.62 C18.1 25.58,21.98 C14.+ 23.62,21.47 23,20.85 23,18.53 U$4.8 | 30,38.4 30,40.2 v30.04,40.84 | 30,38.4 30.9,37.5 35.4,37.5 36,38.1 36,38.96 C11.+ | U$2.5 37.82,41.02 C11.+ | C21.1 7.2,40.08 C12.+ 9.23,39.53 9.9,40.2 9.9,40.8 10.12,41.02 U$1.5 15.02,41.02 v15.83,41.86 | U$3.7 30.19,61.74 v31,62.5
  Route2 0.406: v40.85,54.75 32.85,54.75 32.2,55.44 | 32.2,55.44 v30.95,56.75 | v15.83,41.86 20.6,41.55 22.35,39.8 29.12,39.82 v30.04,40.84 29.7,41.7 29.7,52.5 30.9,53.7 30.9,54.14 32.2,55.44
  Bottom 0.406: v31,62.5 v30.95,56.75